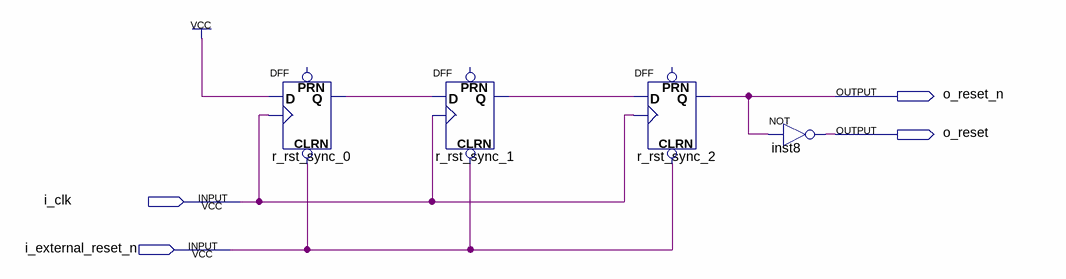
[diagram p0: schematic sheet]
// Quartus schematic reset_sync.bdf as structural Verilog: 4 symbols, 4 pins
module reset_sync (
  input  i_clk,
  input  i_external_reset_n,
  output o_reset_n,
  output o_reset
);

  wire r_rst_sync_0_q, r_rst_sync_1_q;

  DFF r_rst_sync_0 (.CLRN(i_external_reset_n), .CLK(i_clk), .D(1'b1), .Q(r_rst_sync_0_q));  // open: PRN
  DFF r_rst_sync_1 (.CLRN(i_external_reset_n), .CLK(i_clk), .D(r_rst_sync_0_q), .Q(r_rst_sync_1_q));  // open: PRN
  DFF r_rst_sync_2 (.CLRN(i_external_reset_n), .CLK(i_clk), .D(r_rst_sync_1_q), .Q(o_reset_n));  // open: PRN
  not inst8 (o_reset, o_reset_n);
endmodule
